# Altium schematic sheet ConnectorsCircuit.SchDoc
size A4
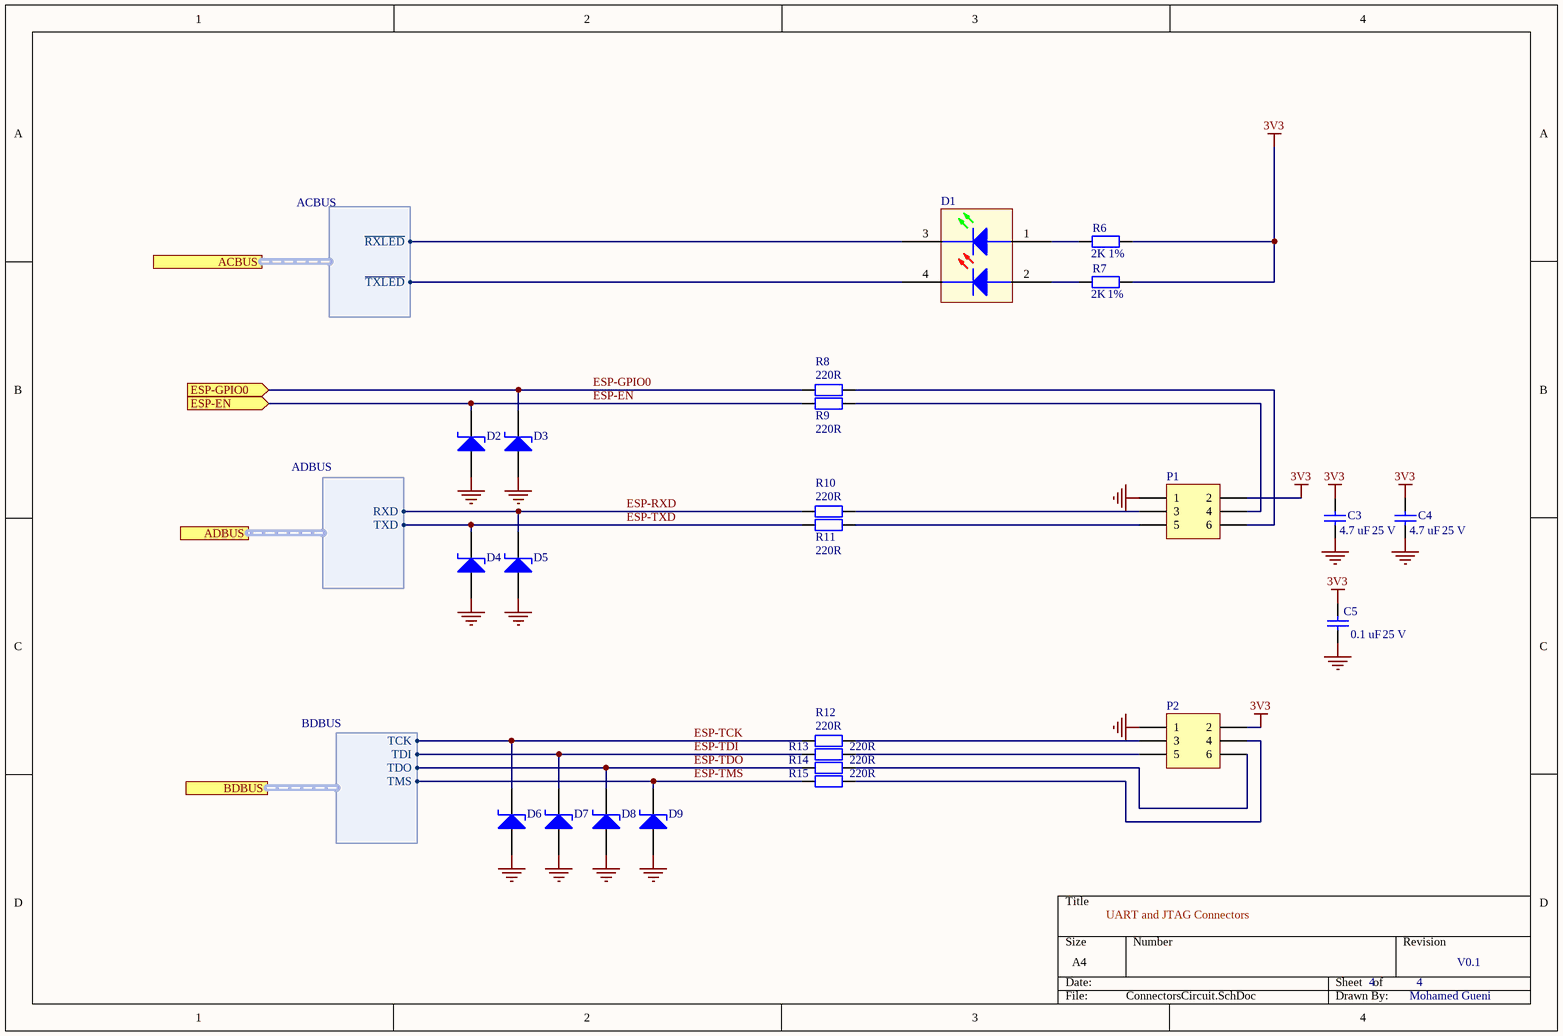
[diagram p0: ConnectorsCircuit.SchDoc]

## Parts
C3  Value 1: 4.7 uF  Value 2: 25 V  [CAP0603]  (hidden comment: Capacitor)
C4  Value 1: 4.7 uF  Value 2: 25 V  [CAP0603]  (hidden comment: Capacitor)
C5  Value 1: 0.1 uF  Value 2: 25 V  [CAP0603]  (hidden comment: Capacitor)
D1  LTST-C155KGJRKT  [LTSTC155KGJRKT]  (value not drawn)
D2  ESD8351HT1G  [SOD-323]  (value not drawn)
D3  ESD8351HT1G  [SOD-323]  (value not drawn)
D4  ESD8351HT1G  [SOD-323]  (value not drawn)
D5  ESD8351HT1G  [SOD-323]  (value not drawn)
D6  ESD8351HT1G  [SOD-323]  (value not drawn)
D7  ESD8351HT1G  [SOD-323]  (value not drawn)
D8  ESD8351HT1G  [SOD-323]  (value not drawn)
D9  ESD8351HT1G  [SOD-323]  (value not drawn)
P1  Header 3X2  [SHDR6W75P200_2X3_865X640X650P]  (value not drawn)
P2  Header 3X2  [SHDR6W75P200_2X3_865X640X650P]  (value not drawn)
R6  Value 1: 2K  TOL: 1%  [RESC2012X65N2k]  (hidden comment: Resistor)
R7  Value 1: 2K  TOL: 1%  [RESC2012X65N2k]  (hidden comment: Resistor)
R8  Value 1: 220R  [RES0603]  (hidden comment: Resistor)
R9  Value 1: 220R  [RES0603]  (hidden comment: Resistor)
R10  Value 1: 220R  [RES0603]  (hidden comment: Resistor)
R11  Value 1: 220R  [RES0603]  (hidden comment: Resistor)
R12  Value 1: 220R  [RES0603]  (hidden comment: Resistor)
R13  Value 1: 220R  [RES0603]  (hidden comment: Resistor)
R14  Value 1: 220R  [RES0603]  (hidden comment: Resistor)
R15  Value 1: 220R  [RES0603]  (hidden comment: Resistor)

## Ports
ACBUS (harness ACBUS), ADBUS (harness ADBUS), BDBUS (harness BDBUS), ESP-EN (in), ESP-GPIO0 (in)

## Harnesses
ADBUS: RXD, TXD
ACBUS: ~{RXLED}, ~{TXLED}
BDBUS: TCK, TDI, TDO, TMS

## Nets
3V3: C3.2 C4.2 C5.2 P1.2 P2.2 R6.2 R7.2
GND: C3.1 C4.1 C5.1 D2.1 D3.1 D4.1 D5.1 D6.1 D7.1 D8.1 D9.1 P1.1 P2.1
ESP-EN: D2.2(K1A2) R9.1 ; port ESP-EN
ESP-GPIO0: D3.2(K1A2) R8.1 ; port ESP-GPIO0
ESP-RXD: D5.2(K1A2) R10.1 ; port ADBUS.RXD
ESP-TCK: D6.2(K1A2) R12.1 ; port BDBUS.TCK
ESP-TDI: D7.2(K1A2) R13.1 ; port BDBUS.TDI
ESP-TDO: D8.2(K1A2) R14.1 ; port BDBUS.TDO
ESP-TMS: D9.2(K1A2) R15.1 ; port BDBUS.TMS
ESP-TXD: D4.2(K1A2) R11.1 ; port ADBUS.TXD
NetD1_1: D1.1 R6.1
NetD1_2: D1.2 R7.1
NetD1_3: D1.3 ; port ACBUS.~{RXLED}
NetD1_4: D1.4 ; port ACBUS.~{TXLED}
NetP1_3: P1.3 R10.2
NetP1_4: P1.4 R9.2
NetP1_5: P1.5 R11.2
NetP1_6: P1.6 R8.2
NetP2_3: P2.3 R12.2
NetP2_4: P2.4 R15.2
NetP2_5: P2.5 R13.2
NetP2_6: P2.6 R14.2

## Notes on the sheet
- UART and JTAG Connectors
- 4
- V0.1
- Mohamed Gueni

## Library data of the parts
C3 C4 = CAP-0001: DES: Multilayer Ceramic Capacitors MLCC - SMD/SMT 0603 25Vdc 4.7uF X6S 10%; MAN: Murata Electronics; MANREF: GRT188C81E475KE13D; SUP: Mouser; SUPREF: 81-GRT188C81E475KE3D; TOL: 10%; N°: CAP-0001; Footprint: 0603; DataSheet: https://eu.mouser.com/datasheet/2/281/product-794242.pdf
C5 = CAP-0005: DES: Multilayer Ceramic Capacitors MLCC - SMD/SMT SOFT 0603 25V 0.1uF X8R 10% AEC-Q200; MAN: TDK; MANREF: CGA3E2X8R1E104K080AE; SUP: Mouser; SUPREF: 810-CGA3E2X8R1E104KA; TOL: 10 %; N°: CAP-0005; Footprint: 0603; DataSheet: https://eu.mouser.com/datasheet/2/400/lcc_automotive_soft_en-843922.pdf
D1 = LED-0001: LTST-C155KGJRKT, Lite-On 571 / 631 nm 2 Green & Red LED, 4-Pin 3125 (1210) SMD package; Geometry.Height: 1.2mm; DES: Standard LEDs - SMD Green/Red Clear; SUP: Mouser; SUPREF: 859-LTST-C155KGJRKT; Value 1: 20 mA; Value 2: 2 V; Mouser Part Number: 859-LTST-C155KGJRKT; Mouser Price/Stock: https://www.mouser.com/Search/Refine.aspx?Keyword=859-LTST-C155KGJRKT; Manufacturer_Name: Lite-On; Manufacturer_Part_Number: LTST-C155KGJRKT; Datasheet Link: https://componentsearchengine.com/Datasheets/1/LTST-C155KGJRKT.pdf; N°: LED-0001; MAN: Lite-On; MANREF: LTST-C155KGJRKT; Footprint: 1311 (3227 metric); DataSheet: https://eu.mouser.com/datasheet/2/239/LTST-C155KGJRKT-1141409.pdf
D2-D9 = D-0001: TVS Unidirectionel; N°: D-0001; DES: ESD Suppressors / TVS Diodes LOW CAP SNAPBACK ESD PROT; MAN: ON Semiconductor; SUP: Mouser; Note: _; SUPREF: 863-ESD8351HT1G; Value 2: 3.3V; DataSheet: https://eu.mouser.com/datasheet/2/308/ESD8351-D-463790.pdf; MANREF: ESD8351HT1G; Footprint: SOD-323-2; Value 1: _; TOL: _
P1 P2 = P-0001: Header, 3-Pin, Dual row; N°: P-0001; DES: Headers & Wire Housings MGrid Hdr Shrd Vt W/ t W/Lck .76AuLF 6Ckt; MAN: Molex / Molex; MANREF: 87833-0620; SUP: Mouser; SUPREF: 538-87833-0620; LatestRevisionDate: 17-Jul-2002; LatestRevisionNote: Re-released for DXP Platform.; Publisher: Altium Limited; Footprint: Through Hole; DataSheet: https://eu.mouser.com/datasheet/2/276/0878330620_PCB_HEADERS-176495.pdf
R6 R7 = RES-0016: DES: Thick Film Resistors 0805 2Kohm 1% Anti Surge AEC-Q200; MAN: ROHM Semiconductor; MANREF: ESR10EZPF2001; SUP: Mouser; SUPREF: 755-ESR10EZPF2001; Value 2: 400 mW; N°: RES-0016; DataSheet: https://eu.mouser.com/datasheet/2/348/esr-e-1139161.pdf; Footprint: 0805
R8-R15 = RES-0018: TOL: 1%; DES: Thick Film Resistors - SMD 1/10Watt 220ohms 1% Commercial Use; MAN: Vishay; MANREF: CRCW0603220RFKEAC; SUP: Mouser; Note: _; SUPREF: 71-CRCW0603220RFKEAC; Value 2: 100mW; N°: RES-0018; DataSheet: https://eu.mouser.com/datasheet/2/427/crcwce3-1223726.pdf; Footprint: 0603